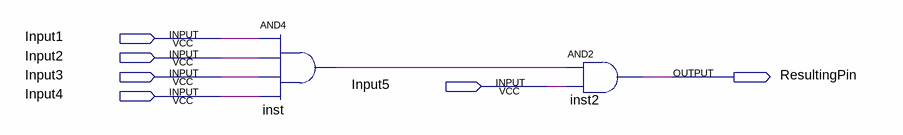
[diagram p0: schematic sheet]
// Quartus schematic and5_1bit.bdf as structural Verilog: 2 symbols, 6 pins
module and5_1bit (
  input  Input1,
  input  Input2,
  input  Input3,
  input  Input5,
  input  Input4,
  output ResultingPin
);

  wire inst_out;

  and inst (inst_out, Input1, Input2, Input3, Input4);
  and inst2 (ResultingPin, inst_out, Input5);
endmodule
